# EasyEDA schematic lab_1.json
TITLE: Sheet_1; REV: 1.0; Date: 2026-07-23; Sheet: 1/1; Company: Your Company
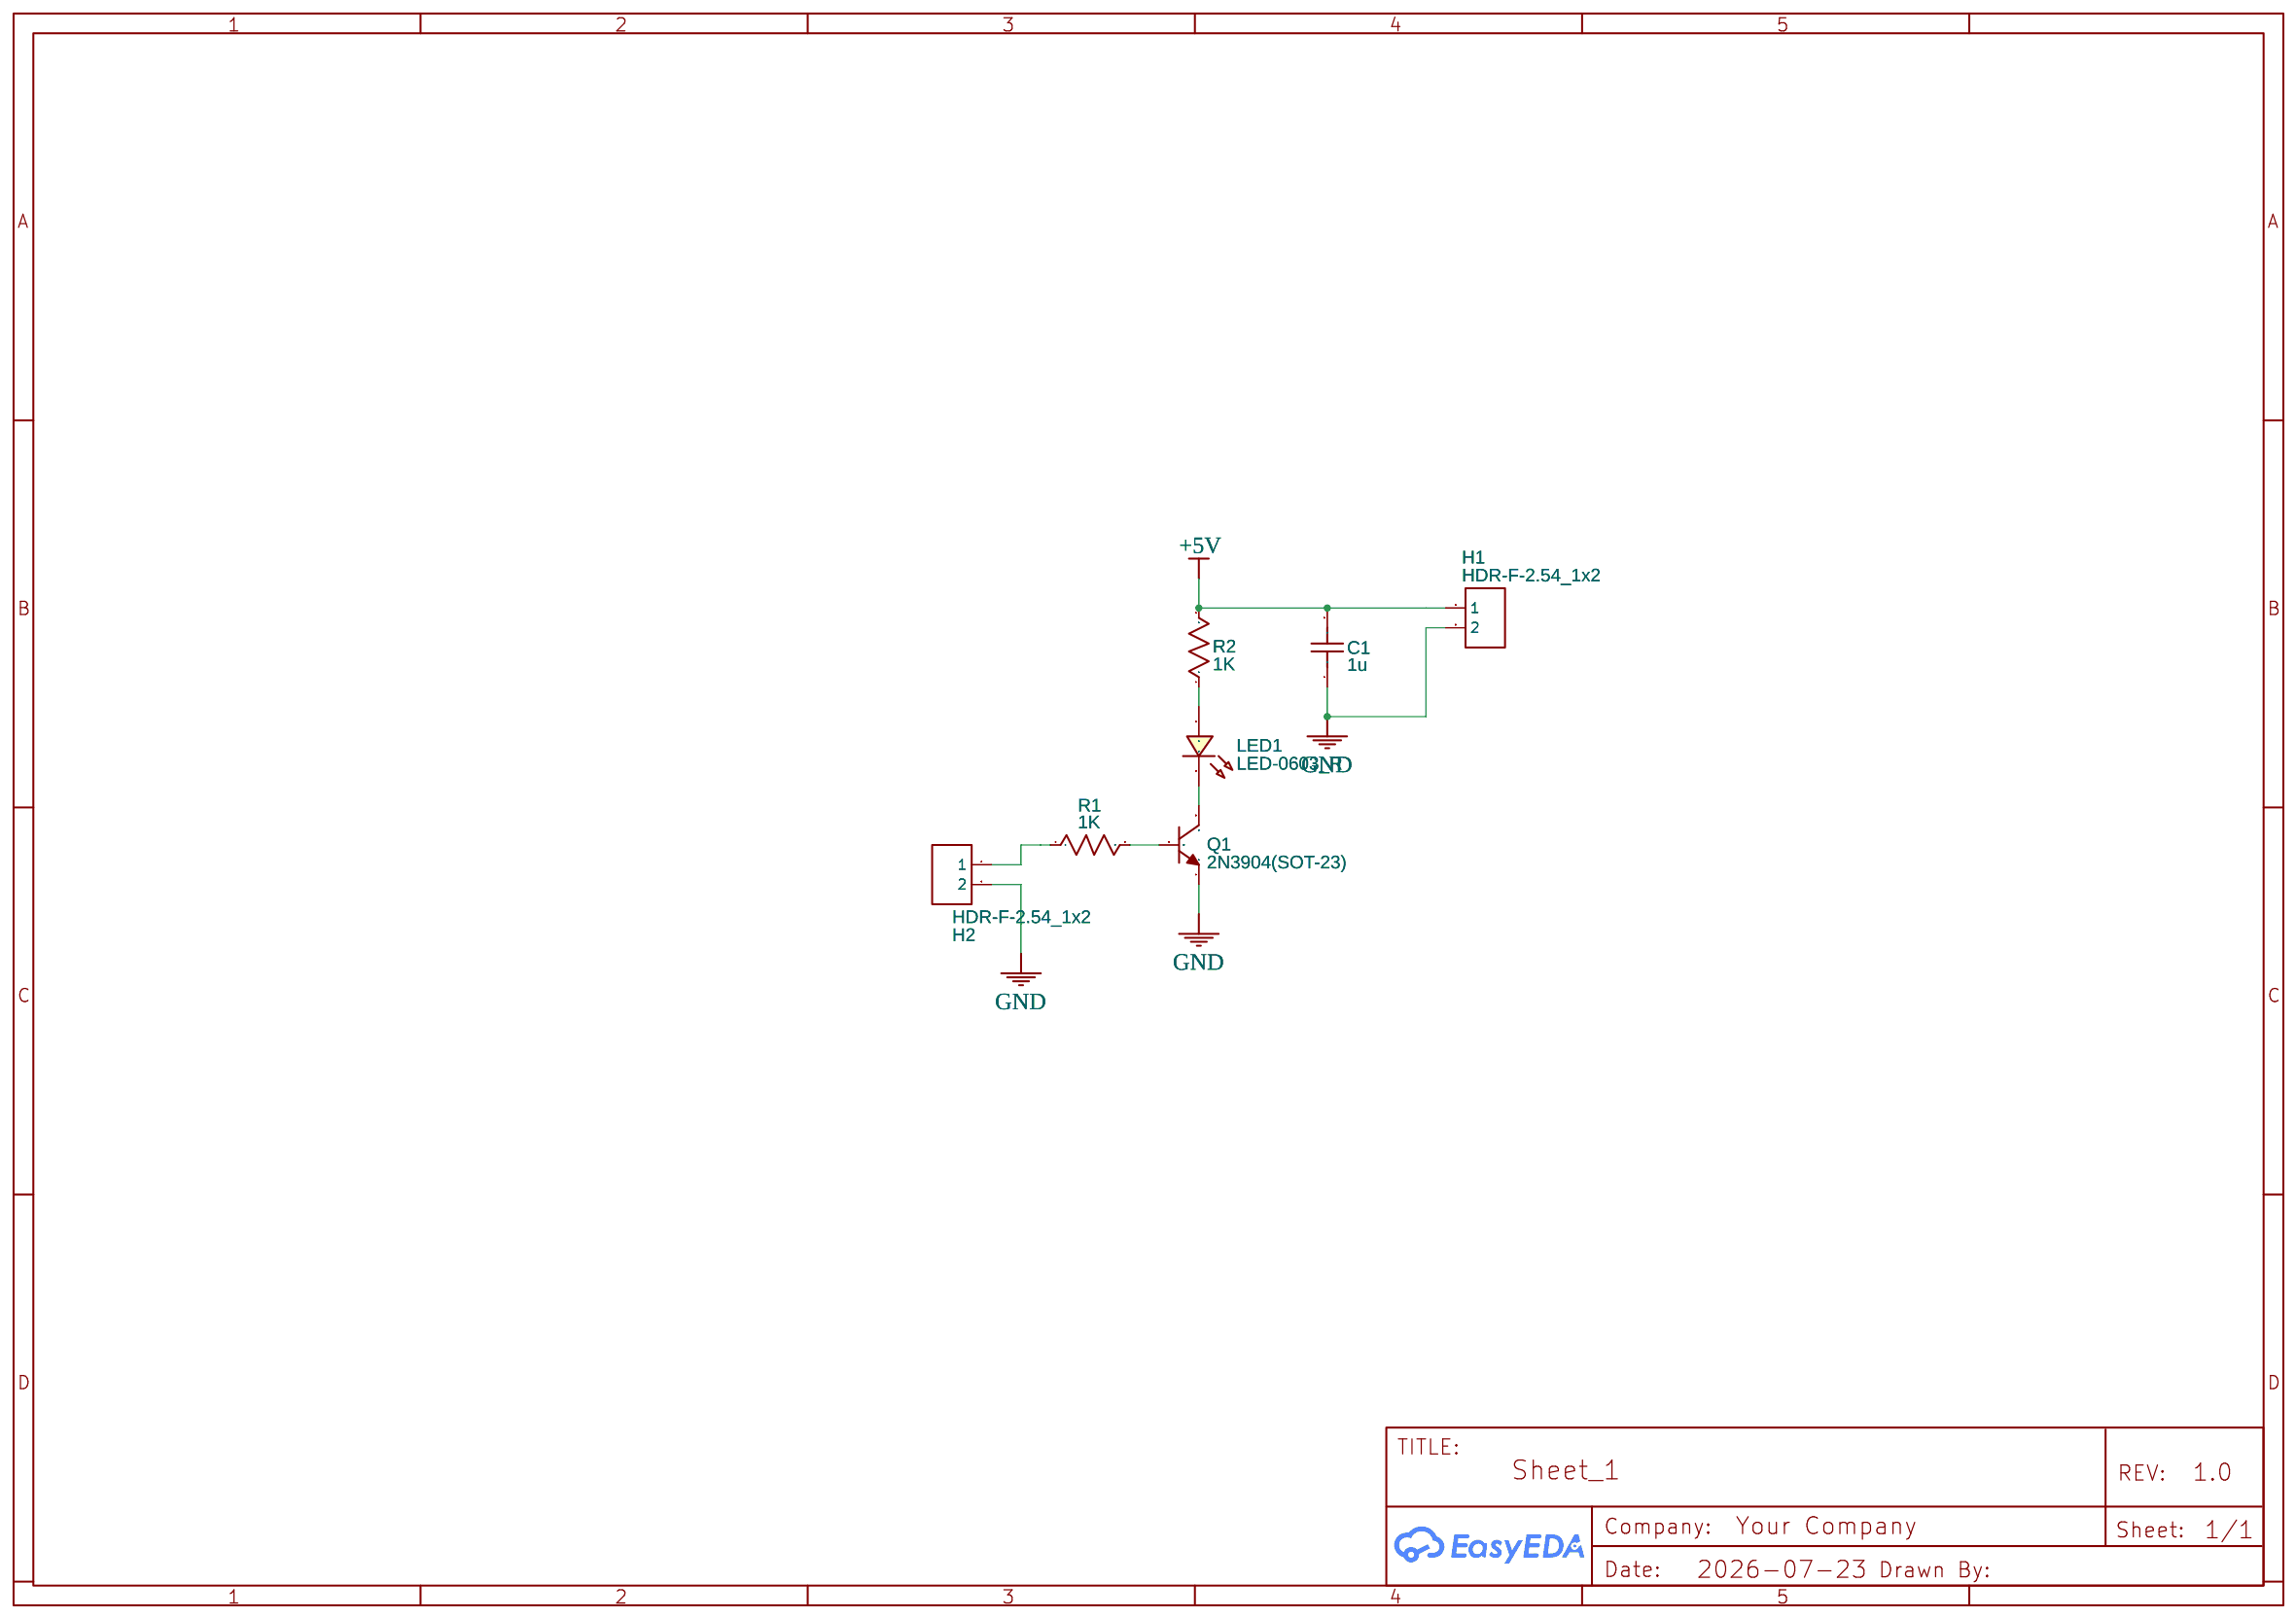
[diagram p0: schematic sheet]

## Parts
C1  1u  [RAD-0.1]
H1  HDR-F-2.54_1x2  [HDR-F-2.54_1X2]
H2  HDR-F-2.54_1x2  [HDR-F-2.54_1X2]
LED1  LED-0603_R  [LED0603_RED]
Q1  2N3904(SOT-23)  [SOT-23-3_L2.9-W1.3-P1.90-LS2.4-TR]
R1  1K  [AXIAL-0.3]
R2  1K  [AXIAL-0.3]

## Library data of the parts
C1 = Capacitor_US: Contributor: EasyEDA; Supplier: YUJING
H1 H2 = HDR-F-2.54_1x2: Supplier Part: C49661; Supplier: LCSC; Contributor: LCEDA_Lib
LED1 = LED-0603_R: Manufacturer: EVERLIGHT(台湾亿光); Manufacturer Part: 19-217/R6C-AL1M2VY/3T; Supplier Part: C72044; Supplier: LCSC; Contributor: LCEDA_01
Q1 = 2N3904(SOT-23): Supplier: LCSC; Manufacturer: KEC; Manufacturer Part: 2n3904S-RTK/PS; Supplier Part: C18536; Paste Type: SOT-23; Contributor: LCEDA_Lib
R1 R2 = Resistor_US: Resistance: 1k; Contributor: EasyEDA; Supplier: YUJING

## Nets
+5V: C1.2 H1.1 R2.2
GND: C1.1 H1.2 H2.2 Q1.1(E)
Net-(H2-1): H2.1 R1.1
Net-(LED1-1): LED1.1 R2.1
Net-(LED1-2): LED1.2 Q1.3(C)
Net-(Q1-2): Q1.2(B) R1.2
